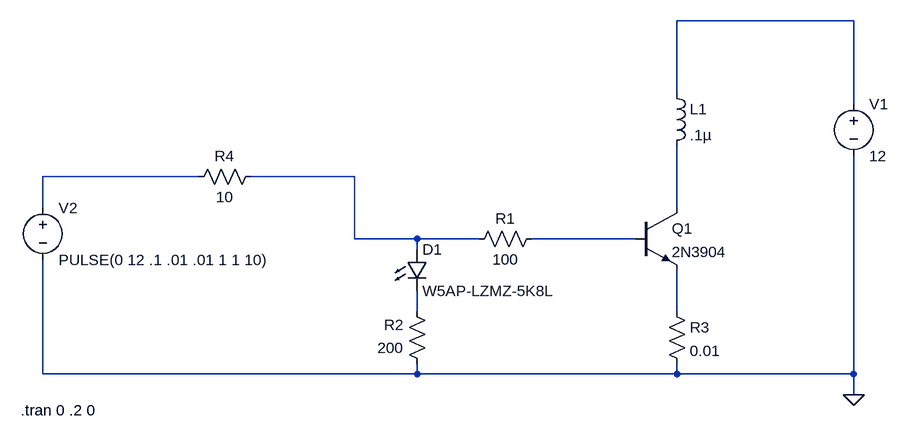
[diagram p0: schematic RelayCircuit.asc]
RelayCircuit.asc, the LTspice schematic file:
Version 4
SHEET 1 880 680
WIRE 576 -128 304 -128
WIRE 304 -16 304 -128
WIRE 576 0 576 -128
WIRE -432 112 -672 112
WIRE -192 112 -352 112
WIRE -672 160 -672 112
WIRE 304 160 304 64
WIRE -192 208 -192 112
WIRE -96 208 -192 208
WIRE 0 208 -96 208
WIRE 240 208 80 208
WIRE -96 224 -96 208
WIRE -96 320 -96 288
WIRE 304 320 304 256
WIRE -672 416 -672 240
WIRE -96 416 -96 400
WIRE -96 416 -672 416
WIRE 304 416 304 400
WIRE 304 416 -96 416
WIRE 576 416 576 80
WIRE 576 416 304 416
WIRE 576 448 576 416
FLAG 576 448 0
SYMBOL npn 240 160 R0
SYMATTR InstName Q1
SYMATTR Value 2N3904
SYMBOL ind 288 -32 R0
SYMATTR InstName L1
SYMATTR Value .1µ
SYMBOL voltage 576 -16 R0
WINDOW 123 0 0 Left 2
WINDOW 39 0 0 Left 2
SYMATTR InstName V1
SYMATTR Value 12
SYMBOL voltage -672 144 R0
WINDOW 123 0 0 Left 2
WINDOW 39 24 124 Left 2
SYMATTR InstName V2
SYMATTR Value PULSE(0 12 .1 .01 .01 1 1 10)
SYMBOL res 96 192 R90
WINDOW 0 0 56 VBottom 2
WINDOW 3 32 56 VTop 2
SYMATTR InstName R1
SYMATTR Value 100
SYMBOL res -80 416 R180
WINDOW 0 36 76 Left 2
WINDOW 3 36 40 Left 2
SYMATTR InstName R2
SYMATTR Value 200
SYMBOL LED -112 224 R0
SYMATTR InstName D1
SYMATTR Value W5AP-LZMZ-5K8L
SYMATTR Description Diode
SYMATTR Type diode
SYMBOL res 288 304 R0
SYMATTR InstName R3
SYMATTR Value 0.01
SYMBOL res -336 96 R90
WINDOW 0 0 56 VBottom 2
WINDOW 3 32 56 VTop 2
SYMATTR InstName R4
SYMATTR Value 10
TEXT -706 472 Left 2 !.tran 0 .2 0

The netlist it stands for:
* RelayCircuit.asc
Q1 N004 N005 N007 0 2N3904
L1 N001 N004 .1µ
V1 N001 0 12
V2 N002 0 PULSE(0 12 .1 .01 .01 1 1 10)
R1 N005 N003 100
R2 0 N006 200
D1 N003 N006 W5AP-LZMZ-5K8L
R3 N007 0 0.01
R4 N003 N002 10
.model D D
.lib standard.dio
.model NPN NPN
.model PNP PNP
.lib standard.bjt
.tran 0 .2 0
.backanno
.end